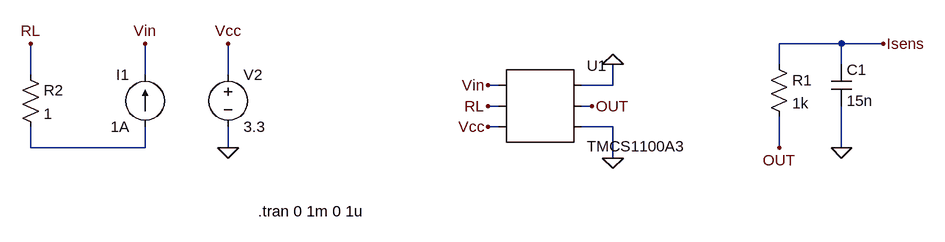
[diagram p0: schematic sensors.asc]
sensors.asc, the LTspice schematic file:
Version 4
SHEET 1 880 680
WIRE 608 -32 512 -32
WIRE 672 -32 608 -32
WIRE 512 0 512 -32
WIRE 608 0 608 -32
WIRE -640 16 -640 -32
WIRE -464 16 -464 -32
WIRE -336 16 -336 -32
WIRE 80 32 64 32
WIRE 256 32 256 0
WIRE 256 32 208 32
WIRE 80 64 64 64
WIRE 224 64 208 64
WIRE 80 96 64 96
WIRE 256 96 208 96
WIRE -640 128 -640 96
WIRE -464 128 -464 96
WIRE -464 128 -640 128
WIRE -336 128 -336 96
WIRE 512 128 512 80
WIRE 608 128 608 64
WIRE 256 144 256 96
FLAG -336 128 0
FLAG -336 -32 Vcc
FLAG 256 0 0
FLAG 608 128 0
FLAG 64 32 Vin
FLAG 64 64 RL
FLAG 64 96 Vcc
FLAG 512 128 OUT
FLAG 224 64 OUT
FLAG 672 -32 Isens
FLAG 256 144 0
FLAG -640 -32 RL
FLAG -464 -32 Vin
SYMBOL AutoGenerated\\TMCS1100A3 144 64 R0
SYMATTR InstName U1
SYMBOL voltage -336 0 R0
WINDOW 123 0 0 Left 0
WINDOW 39 0 0 Left 0
SYMATTR InstName V2
SYMATTR Value 3.3
SYMBOL res 496 -16 R0
SYMATTR InstName R1
SYMATTR Value 1k
SYMBOL cap 592 0 R0
SYMATTR InstName C1
SYMATTR Value 15n
SYMBOL current -464 96 R180
WINDOW 0 24 80 Left 2
WINDOW 3 24 0 Left 2
WINDOW 123 0 0 Left 0
WINDOW 39 0 0 Left 0
SYMATTR InstName I1
SYMATTR Value 1A
SYMBOL res -656 0 R0
SYMATTR InstName R2
SYMATTR Value 1
TEXT -290 226 Left 2 !.tran 0 1m 0 1u

The netlist it stands for:
* sensors.asc
* U1: TMCS1100A3 (symbol AutoGenerated\TMCS1100A3 not available, pins judged from their places): pin1=Vin pin2=RL pin3=Vcc pin4=0 pin5=OUT pin6=0
V2 Vcc 0 3.3
R1 Isens OUT 1k
C1 Isens 0 15n
I1 N001 Vin 1A
R2 RL N001 1
.tran 0 1m 0 1u
.backanno
.end